# Altium project SystemM.PrjPCB
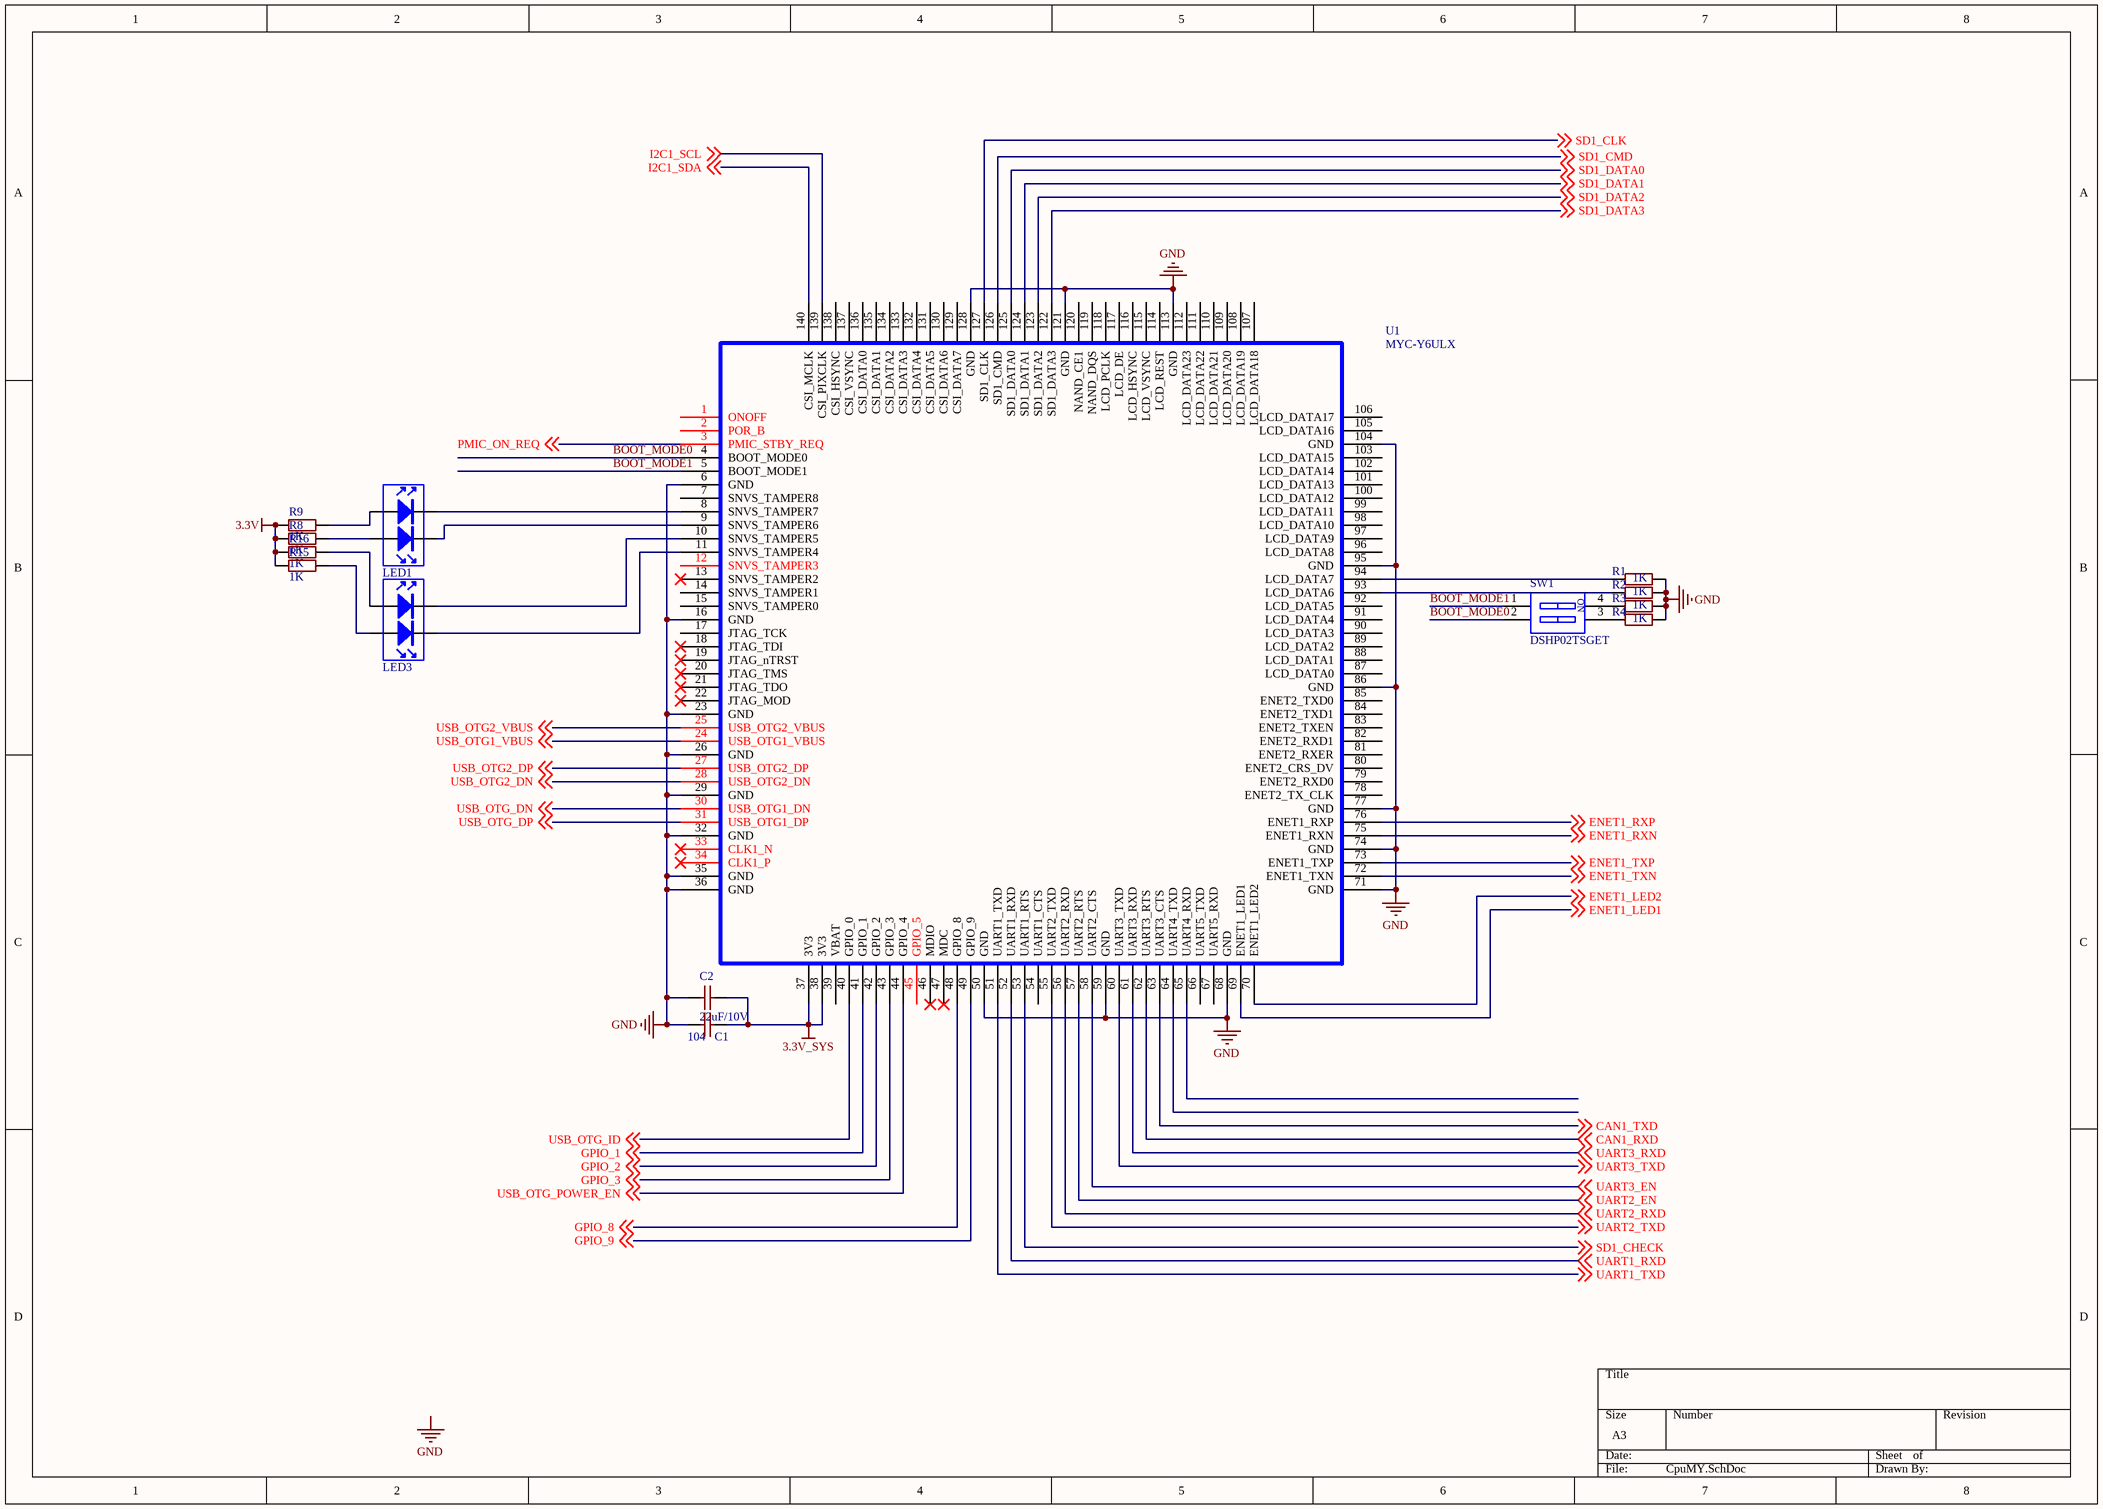
[diagram p0: CpuMY.SchDoc]
6 sheets, 120 parts. Net scope: global (net labels, ports and power ports of the same name join across sheets).
Board file: SystemM.PcbDoc
Sheets:
  CpuMY.SchDoc
  Gpio_RTC.SchDoc
  NetMY.SchDoc
  Power.SchDoc
  Uart_Can.SchDoc
  Usb_SdCard.SchDoc

## Sheet CpuMY.SchDoc
size A3

### Parts
C1  104  [0805SMD_Cap]
C2  22uF/10V  [0805SMD_Cap]
LED1  LED_1  [DIP LED]  (value not drawn)
LED3  LED_1  [DIP LED]  (value not drawn)
R1  1K  [0805_SMD_R]
R2  1K  [0805_SMD_R]
R3  1K  [0805_SMD_R]
R4  1K  [0805_SMD_R]
R8  1K  [0805_SMD_R]
R9  1K  [0805_SMD_R]
R15  1K  [0805_SMD_R]
R16  1K  [0805_SMD_R]
SW1  DSHP02TSGET  [DSHP02TSGET]
U1  MYC-Y6ULX  [MYIMX6]

### Nets
3.3V: R8.1 R9.1 R15.2 R16.2
3.3V_SYS: C1.2 C2.1 U1.37(3V3) U1.38(3V3)
GND: C1.1 C2.2 R1.2 R2.2 R3.2 R4.2 U1.6(GND) U1.16(GND) U1.23(GND) U1.26(GND) U1.29(GND) U1.32(GND) U1.35(GND) U1.36(GND) U1.50(GND) U1.59(GND) U1.68(GND) U1.71(GND) U1.74(GND) U1.77(GND) U1.86(GND) U1.95(GND) U1.104(GND) U1.113(GND) U1.121(GND) U1.128(GND)
BOOT_MODE0: SW1.2(A2) U1.4(BOOT_MODE0)
BOOT_MODE1: SW1.1(A1) U1.5(BOOT_MODE1)
CAN1_RXD: U1.62(UART3_RTS) ; off-sheet CAN1_RXD
CAN1_TXD: U1.63(UART3_CTS) ; off-sheet CAN1_TXD
ENET1_LED1: U1.69(ENET1_LED1) ; off-sheet ENET1_LED1
ENET1_LED2: U1.70(ENET1_LED2) ; off-sheet ENET1_LED2
ENET1_RXN: U1.75(ENET1_RXN) ; off-sheet ENET1_RXN
ENET1_RXP: U1.76(ENET1_RXP) ; off-sheet ENET1_RXP
ENET1_TXN: U1.72(ENET1_TXN) ; off-sheet ENET1_TXN
ENET1_TXP: U1.73(ENET1_TXP) ; off-sheet ENET1_TXP
GPIO_1: U1.41(GPIO_1) ; off-sheet GPIO_1
GPIO_2: U1.42(GPIO_2) ; off-sheet GPIO_2
GPIO_3: U1.43(GPIO_3) ; off-sheet GPIO_3
GPIO_8: U1.48(GPIO_8) ; off-sheet GPIO_8
GPIO_9: U1.49(GPIO_9) ; off-sheet GPIO_9
I2C1_SCL: U1.139(CSI_PIXCLK) ; off-sheet I2C1_SCL
I2C1_SDA: U1.140(CSI_MCLK) ; off-sheet I2C1_SDA
PMIC_ON_REQ: U1.3(PMIC_STBY_REQ) ; off-sheet PMIC_ON_REQ
SD1_CHECK: U1.53(UART1_RTS) ; off-sheet SD1_CHECK
SD1_CLK: U1.127(SD1_CLK) ; off-sheet SD1_CLK
SD1_CMD: U1.126(SD1_CMD) ; off-sheet SD1_CMD
SD1_DATA0: U1.125(SD1_DATA0) ; off-sheet SD1_DATA0
SD1_DATA1: U1.124(SD1_DATA1) ; off-sheet SD1_DATA1
SD1_DATA2: U1.123(SD1_DATA2) ; off-sheet SD1_DATA2
SD1_DATA3: U1.122(SD1_DATA3) ; off-sheet SD1_DATA3
UART1_RXD: U1.52(UART1_RXD) ; off-sheet UART1_RXD
UART1_TXD: U1.51(UART1_TXD) ; off-sheet UART1_TXD
UART2_EN: U1.57(UART2_RTS) ; off-sheet UART2_EN
UART2_RXD: U1.56(UART2_RXD) ; off-sheet UART2_RXD
UART2_TXD: U1.55(UART2_TXD) ; off-sheet UART2_TXD
UART3_EN: U1.58(UART2_CTS) ; off-sheet UART3_EN
UART3_RXD: U1.61(UART3_RXD) ; off-sheet UART3_RXD
UART3_TXD: U1.60(UART3_TXD) ; off-sheet UART3_TXD
USB_OTG1_VBUS: U1.24(USB_OTG1_VBUS) ; off-sheet USB_OTG1_VBUS
USB_OTG2_DN: U1.28(USB_OTG2_DN) ; off-sheet USB_OTG2_DN
USB_OTG2_DP: U1.27(USB_OTG2_DP) ; off-sheet USB_OTG2_DP
USB_OTG2_VBUS: U1.25(USB_OTG2_VBUS) ; off-sheet USB_OTG2_VBUS
USB_OTG_DN: U1.30(USB_OTG1_DN) ; off-sheet USB_OTG_DN
USB_OTG_DP: U1.31(USB_OTG1_DP) ; off-sheet USB_OTG_DP
USB_OTG_ID: U1.40(GPIO_0) ; off-sheet USB_OTG_ID
USB_OTG_POWER_EN: U1.44(GPIO_4) ; off-sheet USB_OTG_POWER_EN
NetLED1_1: LED1.1 R9.2
NetLED1_2: LED1.2 U1.8(SNVS_TAMPER7)
NetLED1_3: LED1.3 R8.2
NetLED1_4: LED1.4 U1.9(SNVS_TAMPER6)
NetLED3_1: LED3.1 R16.1
NetLED3_2: LED3.2 U1.10(SNVS_TAMPER5)
NetLED3_3: LED3.3 R15.1
NetLED3_4: LED3.4 U1.11(SNVS_TAMPER4)
NetR1_1: R1.1 U1.94(LCD_DATA7)
NetR2_1: R2.1 U1.93(LCD_DATA6)
NetR3_1: R3.1 SW1.4(B1)
NetR4_1: R4.1 SW1.3(B2)

Not connected (* = marked no-connect by the designer): U1 1(ONOFF) 2(POR_B) 7(SNVS_TAMPER8) 12(SNVS_TAMPER3) 13(SNVS_TAMPER2)* 14(SNVS_TAMPER1) 15(SNVS_TAMPER0) 17(JTAG_TCK) 18(JTAG_TDI)* 19(JTAG_nTRST)* 20(JTAG_TMS)* 21(JTAG_TDO)* 22(JTAG_MOD)* 33(CLK1_N)* 34(CLK1_P)* 39(VBAT) 45(GPIO_5) 46(MDIO)* 47(MDC)* 54(UART1_CTS) 64(UART4_TXD) 65(UART4_RXD) 66(UART5_TXD) 67(UART5_RXD) 78(ENET2_TX_CLK) 79(ENET2_RXD0) 80(ENET2_CRS_DV) 81(ENET2_RXER) 82(ENET2_RXD1) 83(ENET2_TXEN) 84(ENET2_TXD1) 85(ENET2_TXD0) 87(LCD_DATA0) 88(LCD_DATA1) 89(LCD_DATA2) 90(LCD_DATA3) 91(LCD_DATA4) 92(LCD_DATA5) 96(LCD_DATA8) 97(LCD_DATA9) 98(LCD_DATA10) 99(LCD_DATA11) 100(LCD_DATA12) 101(LCD_DATA13) 102(LCD_DATA14) 103(LCD_DATA15) 105(LCD_DATA16) 106(LCD_DATA17) 107(LCD_DATA18) 108(LCD_DATA19) 109(LCD_DATA20) 110(LCD_DATA21) 111(LCD_DATA22) 112(LCD_DATA23) 114(LCD_REST) 115(LCD_VSYNC) 116(LCD_HSYNC) 117(LCD_DE) 118(LCD_PCLK) 119(NAND_DQS) 120(NAND_CE1) 129(CSI_DATA7) 130(CSI_DATA6) 131(CSI_DATA5) 132(CSI_DATA4) 133(CSI_DATA3) 134(CSI_DATA2) 135(CSI_DATA1) 136(CSI_DATA0) 137(CSI_VSYNC) 138(CSI_HSYNC)

### Notes on the sheet
- Labels drawn without touching a wire or pin: GND
- (in symbol 拨码开关) ON

### Library data of the parts
C1 = SMD_Cap: 贴片电容; 研究所: 贴装电容_0805_0.1uF; 松下: GR21BB1H104K; 松下: GR21BB1H224K; 松下: GR21BB1H103K; 研究所: 贴装电容_0805_0.22uF; 研究所: 贴装电容_0805_0.01uF; 松下: GR21BB1H473K; 研究所: 贴装电容_0805_0.047uF; 松下: GR21BB1H300K; 研究所: 贴装电容_0805_30pF; 松下: GR21BB1H105K; 研究所: 贴装电容_0805_1uF; 松下: GR21BB1H472K; 研究所: 贴装电容_0805_4700pF
C2 = SMD_Cap: 贴片电容; 研究所: 贴装电容_0805_4700pF; 松下: GR21BB1H472K
LED1 LED3 = LED_1: 发光二极管
R1-R4 R8 R9 R15 R16 = SMD_0805: 贴片电阻; 松下: RS05K101FT; 松下: RS05000FT; 松下: RS05K3321FT; 松下: RS05K6811FT; 松下: RS05K102FT; 松下: RS05K2211FT; 松下: RS05K103FT; 松下: RS05K5111FT; 松下: RS05K5110FT; 松下: RS05K5112FT; 松下: RS05K8251FT; 松下: RS05K2212FT; 松下: RS05K104FT; 松下: RS05K5113FT; 松下: RS05K105FT; 松下: RS05L106FT; 研究所: 贴装电阻_0805_0_F1%; 研究所: 贴装电阻_0805_100_F1%; 研究所: 贴装电阻_0805_51.1K_F1%; 研究所: 贴装电阻_0805_1K_F1%; 研究所: 贴装电阻_0805_2.21K_F1%; 研究所: 贴装电阻_0805_3.32K_F1%; 研究所: 贴装电阻_0805_5.11K_F1%; 研究所: 贴装电阻_0805_511K_F1%; 研究所: 贴装电阻_0805_6.81K_F1%; 研究所: 贴装电阻_0805_511_F1%; 研究所: 贴装电阻_0805_8.25K_F1%; 研究所: 贴装电阻_0805_10K_F1%; 研究所: 贴装电阻_0805_22.1K_F1%; 研究所: 贴装电阻_0805_100K_F1%; 研究所: 贴装电阻_0805_1M_F1%; 研究所: 贴装电阻_0805_10M_F1%
SW1 = 拨码开关

## Sheet Gpio_RTC.SchDoc
size A4
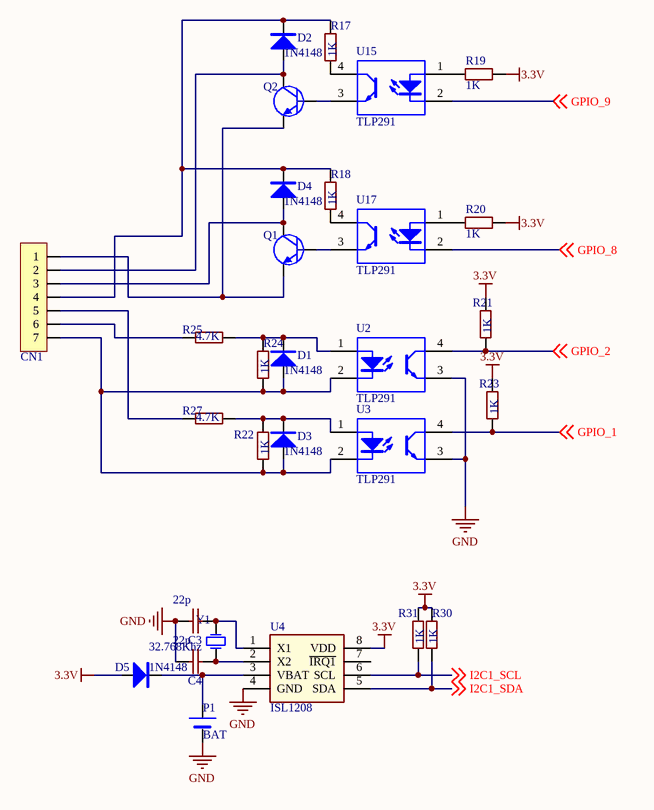
[diagram p1: Gpio_RTC.SchDoc]

### Parts
C3  22p  [0805SMD_Cap]
C4  22p  [0805SMD_Cap]
CN1  CON7  [WJ15EDGRM-3.81-7P]  (value not drawn)
D1  1N4148  [二极管SOD-123]
D2  1N4148  [二极管SOD-123]
D3  1N4148  [二极管SOD-123]
D4  1N4148  [二极管SOD-123]
D5  1N4148  [二极管SOD-123]
P1  BAT  [CR1220]
Q1  1318  [SOT-23]  (value not drawn)
Q2  1318  [SOT-23]  (value not drawn)
R17  1K  [0805_SMD_R]
R18  1K  [0805_SMD_R]
R19  1K  [0805_SMD_R]
R20  1K  [0805_SMD_R]
R21  1K  [0805_SMD_R]
R22  1K  [0805_SMD_R]
R23  1K  [0805_SMD_R]
R24  1K  [0805_SMD_R]
R25  4.7K  [0805_SMD_R]
R27  4.7K  [0805_SMD_R]
R30  1K  [0805_SMD_R]
R31  1K  [0805_SMD_R]
U2  TLP291  [sop-4]
U3  TLP291  [sop-4]
U4  ISL1208  [运放SO8]
U15  TLP291  [sop-4]
U17  TLP291  [sop-4]
Y1  32.768Khz  [XTAL_0503_2Pin]

### Nets
3.3V: D5.A R19.1 R20.1 R21.2 R23.2 R30.1 R31.1 U4.8(VDD)
GND: C3.1 C4.1 P1.2(-) U2.3 U3.3 U4.4(GND)
GPIO_1: R23.1 U3.4 ; off-sheet GPIO_1
GPIO_2: R21.1 U2.4 ; off-sheet GPIO_2
GPIO_8: U17.2 ; off-sheet GPIO_8
GPIO_9: U15.2 ; off-sheet GPIO_9
I2C1_SCL: R31.2 U4.6(SCL) ; off-sheet I2C1_SCL
I2C1_SDA: R30.2 U4.5(SDA) ; off-sheet I2C1_SDA
NetC3_2: C3.2 U4.1(X1) Y1.2(OSC2)
NetC4_2: C4.2 U4.2(X2) Y1.1(OSC1)
NetCN1_1: CN1.1 Q1.2(E) Q2.2(E)
NetCN1_2: CN1.2 D2.A Q2.3(C)
NetCN1_3: CN1.3 D4.A Q1.3(C)
NetCN1_4: CN1.4 D2.K D4.K R17.2 R18.2
NetCN1_5: CN1.5 R27.1
NetCN1_6: CN1.6 R25.1
NetCN1_7: CN1.7 D1.A D3.A R22.1 R24.1 U2.2 U3.2
NetD1_K: D1.K R24.2 R25.2 U2.1
NetD3_K: D3.K R22.2 R27.2 U3.1
NetD5_K: D5.K P1.1(+) U4.3(VBAT)
NetQ1_1: Q1.1(B) U17.3
NetQ2_1: Q2.1(B) U15.3
NetR17_1: R17.1 U15.4
NetR18_1: R18.1 U17.4
NetR19_2: R19.2 U15.1
NetR20_2: R20.2 U17.1

Not connected (* = marked no-connect by the designer): U4 7(~{IR}~{Q1})

### Library data of the parts
C3 C4 = SMD_Cap: as C1 on sheet CpuMY
CN1 = CON7: 连接器; 松下: B6BXH2TV4
D1-D5 = DIODE: 二极管
Q1 Q2 = 三极管: Published: 8-Jun-2000; LatestRevisionDate: 17-Jul-2002; LatestRevisionNote: Re-released for DXP Platform.; PackageReference: TO-226; Publisher: Altium Limited; Code_JEDEC: TO-226-AA
R17-R25 R27 R30 R31 = SMD_0805: as R1 on sheet CpuMY
U4 = ISL1208: 时钟芯片
Y1 = XTAL: 无源晶振贴装; Published: 8-Jun-2000; LatestRevisionDate: 17-Jul-2002; LatestRevisionNote: Re-released for DXP Platform.; PackageReference: R38; Publisher: Altium Limited

## Sheet NetMY.SchDoc
size A4
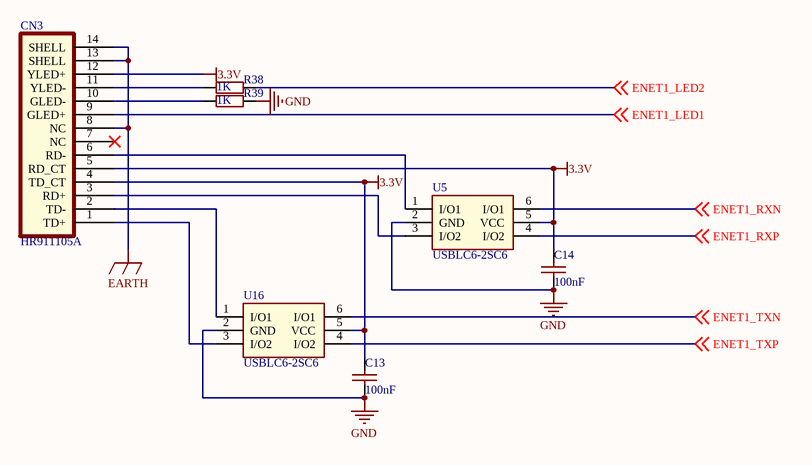
[diagram p2: NetMY.SchDoc]

### Parts
C13  100nF  [0805SMD_Cap]
C14  100nF  [0805SMD_Cap]
CN3  HR911105A  [RJ-45A12]
R38  1K  [0805_SMD_R]
R39  1K  [0805_SMD_R]
U5  USBLC6-2SC6  [SOT-23-6]
U16  USBLC6-2SC6  [SOT-23-6]

### Nets
3.3V: C13.2 C14.2 CN3.4(TD_CT) CN3.5(RD_CT) CN3.12(YLED+) U5.5(VCC) U16.5(VCC)
EARTH: CN3.8(NC) CN3.13(SHELL) CN3.14(SHELL)
GND: C13.1 C14.1 R39.2 U5.2(GND) U16.2(GND)
ENET1_LED1: CN3.9(GLED+) ; off-sheet ENET1_LED1
ENET1_LED2: R38.2 ; off-sheet ENET1_LED2
ENET1_RXN: U5.6(I/O1) ; off-sheet ENET1_RXN
ENET1_RXP: U5.4(I/O2) ; off-sheet ENET1_RXP
ENET1_TXN: U16.6(I/O1) ; off-sheet ENET1_TXN
ENET1_TXP: U16.4(I/O2) ; off-sheet ENET1_TXP
NetCN3_1: CN3.1(TD+) U16.3(I/O2)
NetCN3_2: CN3.2(TD-) U16.1(I/O1)
NetCN3_3: CN3.3(RD+) U5.3(I/O2)
NetCN3_6: CN3.6(RD-) U5.1(I/O1)
NetCN3_10: CN3.10(GLED-) R39.1
NetCN3_11: CN3.11(YLED-) R38.1

Not connected (* = marked no-connect by the designer): CN3 7(NC)*

### Library data of the parts
C13 C14 = SMD_Cap: as C2 on sheet CpuMY
R38 R39 = SMD_0805: as R1 on sheet CpuMY

## Sheet Power.SchDoc
size A4
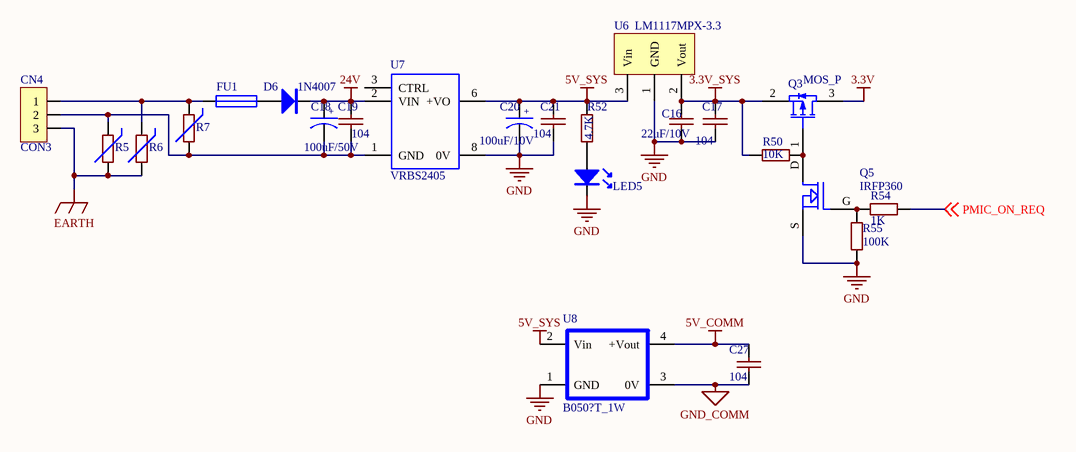
[diagram p3: Power.SchDoc]

### Parts
C16  22uF/10V  [0805SMD_Cap]
C17  104  [0805SMD_Cap]
C18  100uF/50V  [电解电容-10]
C19  104  [0805SMD_Cap]
C20  100uF/10V  [电解电容-10]
C21  104  [0805SMD_Cap]
C27  104  [0805SMD_Cap]
CN4  CON3  [WJ15EDGRM-3.81-3P-14-00A]
D6  1N4007  [二极管SMA]
FU1  FUSE1  [RAD0.2]  (value not drawn)
LED5  LED  [发光二极管0805]  (value not drawn)
Q3  MOS_P  [SOT-23]
Q5  IRFP360  [SOT-23 - MOS]
R5  10d330K  [RAD0.2]  (value not drawn)
R6  10d330K  [RAD0.2]  (value not drawn)
R7  10d330K  [RAD0.2]  (value not drawn)
R50  10K  [0805_SMD_R]
R52  4.7K  [0805_SMD_R]
R54  1K  [0805_SMD_R]
R55  100K  [0805_SMD_R]
U6  LM1117MPX-3.3  [SOT-223]
U7  VRBS2405  [VRB_S]
U8  B050?T_1W  [B0505S_1W]

### Nets
3.3V: Q3.3(D)
3.3V_SYS: C16.1 C17.1 Q3.2(S) R50.2 U6.2(Vout)
5V_COMM: C27.1 U8.4(+Vout)
5V_SYS: C20.1 C21.1 R52.2 U6.3(Vin) U7.6(+VO) U8.2(Vin)
24V: C18.1 C19.1 D6.K U7.2(VIN)
EARTH: CN4.3 R5.1 R6.1
GND: C16.2 C17.2 C20.2 C21.2 LED5.K Q5.S(SOURCE) R55.2 U6.1(GND) U7.8(0V) U8.1(GND)
GND_COMM: C27.2 U8.3(0V)
PMIC_ON_REQ: R54.1 ; off-sheet PMIC_ON_REQ
NetC18_2: C18.2 C19.2 CN4.2 R5.2 R7.1 U7.1(GND)
NetCN4_1: CN4.1 FU1.1 R6.2 R7.2
NetD6_A: D6.A FU1.2
NetLED5_A: LED5.A R52.1
NetQ3_1: Q3.1(G) Q5.D(DRAIN) R50.1
NetQ5_G: Q5.G(GATE) R54.2 R55.1

Not connected (* = marked no-connect by the designer): U7 3(CTRL) 5(NC) 7(NC)

### Notes on the sheet
- (in symbol CAP  POL) +

### Library data of the parts
C16 = SMD_Cap: as C2 on sheet CpuMY
C17 C19 C21 C27 = SMD_Cap: as C1 on sheet CpuMY
C18 C20 = CAP  POL: 电解电容; Value: R1HCX010MT50
CN4 = CON3: 连接器; 松下: B3PVHB
D6 = DIODE: 二极管
FU1 = FUSE1: 保险
LED5 = LED: 发光二极管
Q5 = MOSFET N: MOS管
R5-R7 = 压敏电阻: 松下: RS05K101FT; 松下: RS05000FT; 松下: RS05K3321FT; 松下: RS05K6811FT; 松下: RS05K102FT; 松下: RS05K2211FT; 松下: RS05K103FT; 松下: RS05K5111FT; 松下: RS05K5110FT; 松下: RS05K5112FT; 松下: RS05K8251FT; 松下: RS05K2212FT; 松下: RS05K104FT; 松下: RS05K5113FT; 松下: RS05K105FT; 松下: RS05L106FT; 研究所: 贴装电阻_0805_0_F1%; 研究所: 贴装电阻_0805_100_F1%; 研究所: 贴装电阻_0805_51.1K_F1%; 研究所: 贴装电阻_0805_1K_F1%; 研究所: 贴装电阻_0805_2.21K_F1%; 研究所: 贴装电阻_0805_3.32K_F1%; 研究所: 贴装电阻_0805_5.11K_F1%; 研究所: 贴装电阻_0805_511K_F1%; 研究所: 贴装电阻_0805_6.81K_F1%; 研究所: 贴装电阻_0805_511_F1%; 研究所: 贴装电阻_0805_8.25K_F1%; 研究所: 贴装电阻_0805_10K_F1%; 研究所: 贴装电阻_0805_22.1K_F1%; 研究所: 贴装电阻_0805_100K_F1%; 研究所: 贴装电阻_0805_1M_F1%; 研究所: 贴装电阻_0805_10M_F1%
R50 R52 R54 R55 = SMD_0805: as R1 on sheet CpuMY
U6 = LM1117MPX-3.3: LM1117 3.3V固定输出; 编号: B00004; 名称: 贴装芯片_LM1117MPX-3.3
U8 = B0505S_1W

## Sheet Uart_Can.SchDoc
size A4
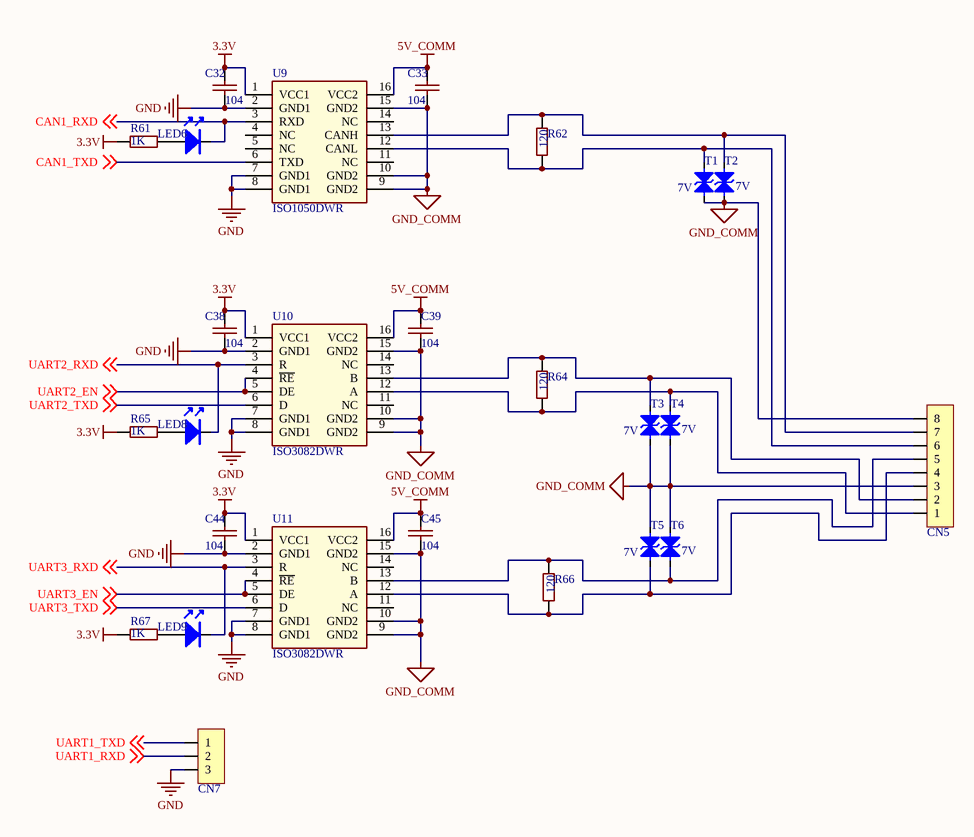
[diagram p4: Uart_Can.SchDoc]

### Parts
C32  104  [0805SMD_Cap]
C33  104  [0805SMD_Cap]
C38  104  [0805SMD_Cap]
C39  104  [0805SMD_Cap]
C44  104  [0805SMD_Cap]
C45  104  [0805SMD_Cap]
CN5  CON8  [WJ15EDGRM-3.81-8P]  (value not drawn)
CN7  CON3  [DIP3]  (value not drawn)
LED6  LED  [发光二极管0805]  (value not drawn)
LED8  LED  [发光二极管0805]  (value not drawn)
LED9  LED  [发光二极管0805]  (value not drawn)
R61  1K  [0805_SMD_R]
R62  120  [0805_SMD_R]
R64  120  [0805_SMD_R]
R65  1K  [0805_SMD_R]
R66  120  [0805_SMD_R]
R67  1K  [0805_SMD_R]
T1  7V  [二极管SMA]
T2  7V  [二极管SMA]
T3  7V  [二极管SMA]
T4  7V  [二极管SMA]
T5  7V  [二极管SMA]
T6  7V  [二极管SMA]
U9  ISO1050DWR  [SOIC_16]
U10  ISO3082DWR  [SOIC_16]
U11  ISO3082DWR  [SOIC_16]

### Nets
3.3V: C32.2 C38.2 C44.2 R61.2 R65.2 R67.2 U9.1(VCC1) U10.1(VCC1) U11.1(VCC1)
5V_COMM: C33.2 C39.2 C45.2 U9.16(VCC2) U10.16(VCC2) U11.16(VCC2)
GND: C32.1 C38.1 C44.1 CN7.3 U9.2(GND1) U9.7(GND1) U9.8(GND1) U10.2(GND1) U10.7(GND1) U10.8(GND1) U11.2(GND1) U11.7(GND1) U11.8(GND1)
GND_COMM: C33.1 C39.1 C45.1 CN5.3 CN5.8 T1.A T2.A T3.A T4.A T5.K T6.K U9.9(GND2) U9.10(GND2) U9.15(GND2) U10.9(GND2) U10.10(GND2) U10.15(GND2) U11.9(GND2) U11.10(GND2) U11.15(GND2)
CAN1_RXD: LED6.K U9.3(RXD) ; off-sheet CAN1_RXD
CAN1_TXD: U9.6(TXD) ; off-sheet CAN1_TXD
UART1_RXD: CN7.2 ; off-sheet UART1_RXD
UART1_TXD: CN7.1 ; off-sheet UART1_TXD
UART2_EN: U10.4(~{RE}) U10.5(DE) ; off-sheet UART2_EN
UART2_RXD: LED8.K U10.3(R) ; off-sheet UART2_RXD
UART2_TXD: U10.6(D) ; off-sheet UART2_TXD
UART3_EN: U11.4(~{RE}) U11.5(DE) ; off-sheet UART3_EN
UART3_RXD: LED9.K U11.3(R) ; off-sheet UART3_RXD
UART3_TXD: U11.6(D) ; off-sheet UART3_TXD
NetCN5_1: CN5.1 R64.1 T4.K U10.12(A)
NetCN5_2: CN5.2 R64.2 T3.K U10.13(B)
NetCN5_4: CN5.4 R66.1 T5.A U11.12(A)
NetCN5_5: CN5.5 R66.2 T6.A U11.13(B)
NetCN5_6: CN5.6 R62.1 T1.K U9.12(CANL)
NetCN5_7: CN5.7 R62.2 T2.K U9.13(CANH)
NetLED6_A: LED6.A R61.1
NetLED8_A: LED8.A R65.1
NetLED9_A: LED9.A R67.1

Not connected (* = marked no-connect by the designer): U9 4(NC) 5(NC) 11(NC) 14(NC); U10 11(NC) 14(NC); U11 11(NC) 14(NC)

### Library data of the parts
C32 C33 C38 C39 C44 C45 = SMD_Cap: as C1 on sheet CpuMY
CN5 = CON8: 连接器; 松下: B9PVHB
CN7 = CON3: 连接器; 松下: B3PVHB
LED6 LED8 LED9 = LED: 发光二极管
R61 R62 R64-R67 = SMD_0805: as R1 on sheet CpuMY
T1-T6 = 双向TVS_?V(SMA): 名称: 贴装元件_双向TVS_7V(SMA)
U9 = ISO1050DWR: CAN隔离芯片
U10 U11 = ISO3082DWR: 485隔离芯片

## Sheet Usb_SdCard.SchDoc
size A4
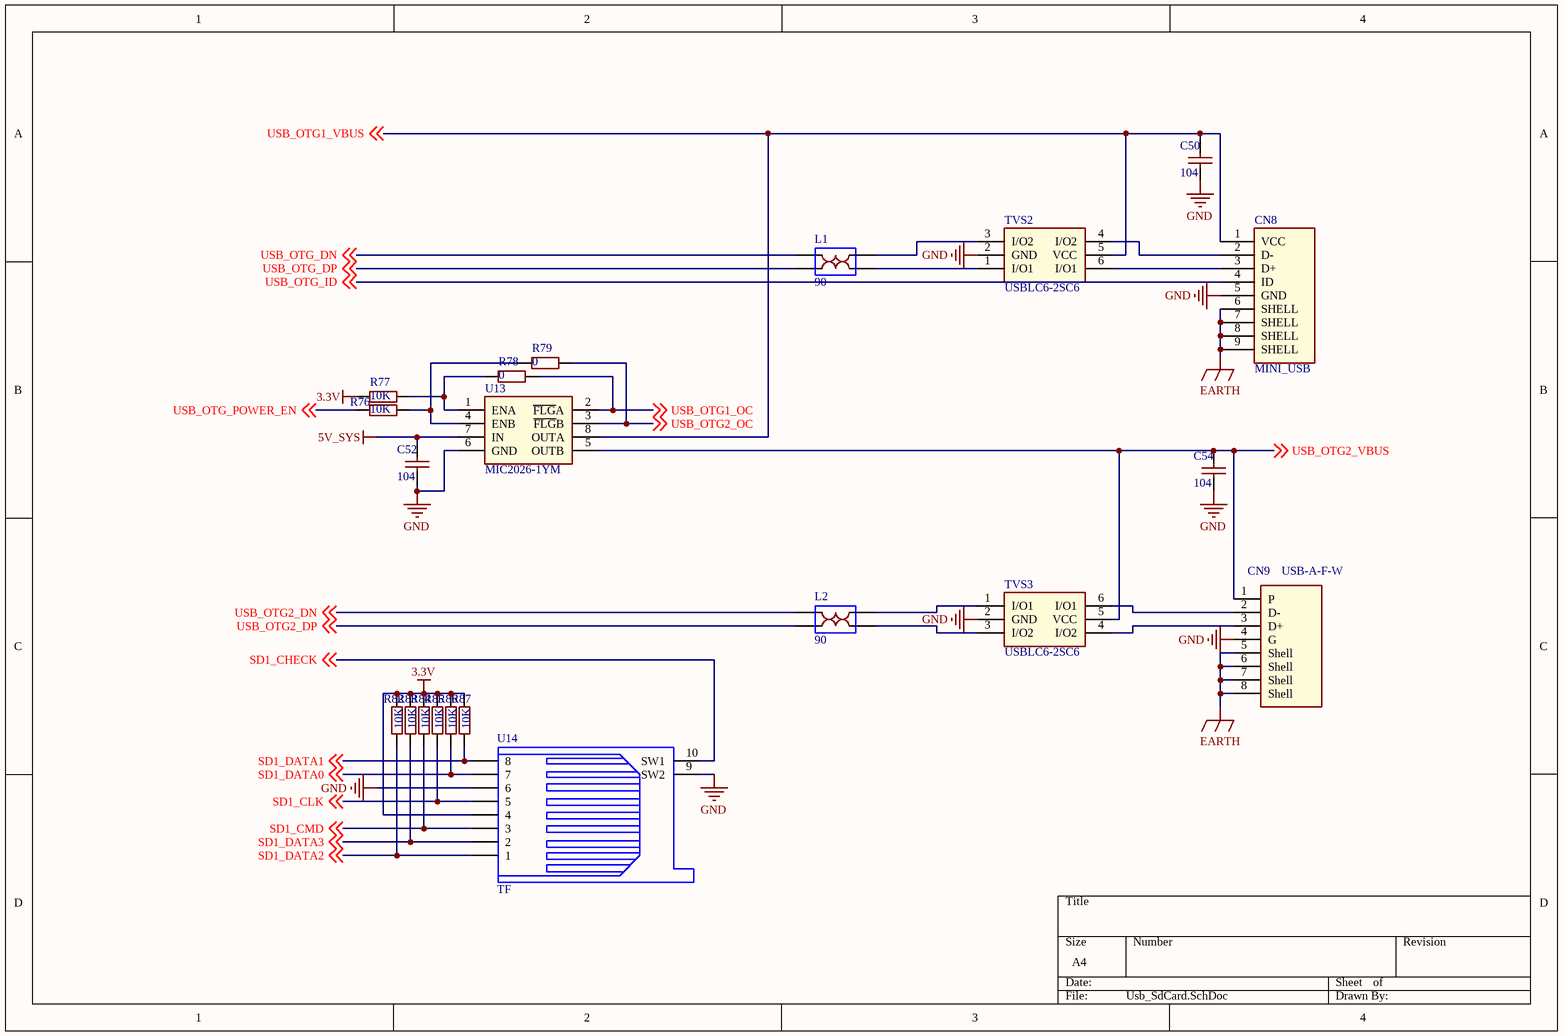
[diagram p5: Usb_SdCard.SchDoc]

### Parts
C50  104  [0805SMD_Cap]
C52  104  [0805SMD_Cap]
C54  104  [0805SMD_Cap]
CN8  MINI_USB  [MICRO_USB]
CN9  USB-A-F-W  [USB-C]
L1  90  [2012]
L2  90  [2012]
R76  10K  [0805_SMD_R]
R77  10K  [0805_SMD_R]
R78  0  [0805_SMD_R]
R79  0  [0805_SMD_R]
R82  10K  [0805_SMD_R]
R83  10K  [0805_SMD_R]
R84  10K  [0805_SMD_R]
R85  10K  [0805_SMD_R]
R86  10K  [0805_SMD_R]
R87  10K  [0805_SMD_R]
TVS2  USBLC6-2SC6  [SOT-23-6]
TVS3  USBLC6-2SC6  [SOT-23-6]
U13  MIC2026-1YM  [运放SO8]
U14  TF  [TF]

### Nets
3.3V: R77.2 R82.2 R83.2 R84.2 R85.2 R86.2 R87.2 U14.4
5V_SYS: C52.1 U13.7(IN)
EARTH: CN8.6(SHELL) CN8.7(SHELL) CN8.8(SHELL) CN8.9(SHELL) CN9.5(Shell) CN9.6(Shell) CN9.7(Shell) CN9.8(Shell)
GND: C50.2 C52.2 C54.2 CN8.5(GND) CN9.4(G) TVS2.2(GND) TVS3.2(GND) U13.6(GND) U14.6 U14.9(SW2)
SD1_CHECK: U14.10(SW1) ; off-sheet SD1_CHECK
SD1_CLK: R85.1 U14.5 ; off-sheet SD1_CLK
SD1_CMD: R84.1 U14.3 ; off-sheet SD1_CMD
SD1_DATA0: R86.1 U14.7 ; off-sheet SD1_DATA0
SD1_DATA1: R87.1 U14.8 ; off-sheet SD1_DATA1
SD1_DATA2: R82.1 U14.1 ; off-sheet SD1_DATA2
SD1_DATA3: R83.1 U14.2 ; off-sheet SD1_DATA3
USB_OTG1_OC: R78.1 U13.2(~{FLG}A) ; off-sheet USB_OTG1_OC
USB_OTG1_VBUS: C50.1 CN8.1(VCC) TVS2.5(VCC) U13.8(OUTA) ; off-sheet USB_OTG1_VBUS
USB_OTG2_DN: L2.1 ; off-sheet USB_OTG2_DN
USB_OTG2_DP: L2.2 ; off-sheet USB_OTG2_DP
USB_OTG2_OC: R79.1 U13.3(~{FLG}B) ; off-sheet USB_OTG2_OC
USB_OTG2_VBUS: C54.1 CN9.1(P) TVS3.5(VCC) U13.5(OUTB) ; off-sheet USB_OTG2_VBUS
USB_OTG_DN: L1.2 ; off-sheet USB_OTG_DN
USB_OTG_DP: L1.1 ; off-sheet USB_OTG_DP
USB_OTG_ID: CN8.4(ID) ; off-sheet USB_OTG_ID
USB_OTG_POWER_EN: R76.2 ; off-sheet USB_OTG_POWER_EN
NetCN8_2: CN8.2(D-) TVS2.4(I/O2)
NetCN8_3: CN8.3(D+) TVS2.6(I/O1)
NetCN9_2: CN9.2(D-) TVS3.6(I/O1)
NetCN9_3: CN9.3(D+) TVS3.4(I/O2)
NetL1_3: L1.3 TVS2.3(I/O2)
NetL1_4: L1.4 TVS2.1(I/O1)
NetL2_3: L2.3 TVS3.3(I/O2)
NetL2_4: L2.4 TVS3.1(I/O1)
NetR76_1: R76.1 R79.2 U13.4(ENB)
NetR77_1: R77.1 R78.2 U13.1(ENA)

### Library data of the parts
C50 C52 C54 = SMD_Cap: as C1 on sheet CpuMY
L1 L2 = 共模电感
R76-R79 R82-R87 = SMD_0805: as R1 on sheet CpuMY

## Nets that join several sheets
3.3V: CpuMY (R8.1 R9.1 R15.2 R16.2), Gpio_RTC (8 pins), NetMY (7 pins), Power (Q3.3), Uart_Can (9 pins), Usb_SdCard (8 pins)
3.3V_SYS: CpuMY (C1.2 C2.1 U1.37 U1.38), Power (5 pins)
5V_COMM: Power (C27.1 U8.4), Uart_Can (6 pins)
5V_SYS: Power (6 pins), Usb_SdCard (C52.1 U13.7)
EARTH: NetMY (CN3.8 CN3.13 CN3.14), Power (CN4.3 R5.1 R6.1), Usb_SdCard (8 pins)
GND: CpuMY (26 pins), Gpio_RTC (6 pins), NetMY (5 pins), Power (10 pins), Uart_Can (13 pins), Usb_SdCard (10 pins)
GND_COMM: Power (C27.2 U8.3), Uart_Can (20 pins)
CAN1_RXD: CpuMY (U1.62), Uart_Can (LED6.K U9.3)
CAN1_TXD: CpuMY (U1.63), Uart_Can (U9.6)
ENET1_LED1: CpuMY (U1.69), NetMY (CN3.9)
ENET1_LED2: CpuMY (U1.70), NetMY (R38.2)
ENET1_RXN: CpuMY (U1.75), NetMY (U5.6)
ENET1_RXP: CpuMY (U1.76), NetMY (U5.4)
ENET1_TXN: CpuMY (U1.72), NetMY (U16.6)
ENET1_TXP: CpuMY (U1.73), NetMY (U16.4)
GPIO_1: CpuMY (U1.41), Gpio_RTC (R23.1 U3.4)
GPIO_2: CpuMY (U1.42), Gpio_RTC (R21.1 U2.4)
GPIO_8: CpuMY (U1.48), Gpio_RTC (U17.2)
GPIO_9: CpuMY (U1.49), Gpio_RTC (U15.2)
I2C1_SCL: CpuMY (U1.139), Gpio_RTC (R31.2 U4.6)
I2C1_SDA: CpuMY (U1.140), Gpio_RTC (R30.2 U4.5)
PMIC_ON_REQ: CpuMY (U1.3), Power (R54.1)
SD1_CHECK: CpuMY (U1.53), Usb_SdCard (U14.10)
SD1_CLK: CpuMY (U1.127), Usb_SdCard (R85.1 U14.5)
SD1_CMD: CpuMY (U1.126), Usb_SdCard (R84.1 U14.3)
SD1_DATA0: CpuMY (U1.125), Usb_SdCard (R86.1 U14.7)
SD1_DATA1: CpuMY (U1.124), Usb_SdCard (R87.1 U14.8)
SD1_DATA2: CpuMY (U1.123), Usb_SdCard (R82.1 U14.1)
SD1_DATA3: CpuMY (U1.122), Usb_SdCard (R83.1 U14.2)
UART1_RXD: CpuMY (U1.52), Uart_Can (CN7.2)
UART1_TXD: CpuMY (U1.51), Uart_Can (CN7.1)
UART2_EN: CpuMY (U1.57), Uart_Can (U10.4 U10.5)
UART2_RXD: CpuMY (U1.56), Uart_Can (LED8.K U10.3)
UART2_TXD: CpuMY (U1.55), Uart_Can (U10.6)
UART3_EN: CpuMY (U1.58), Uart_Can (U11.4 U11.5)
UART3_RXD: CpuMY (U1.61), Uart_Can (LED9.K U11.3)
UART3_TXD: CpuMY (U1.60), Uart_Can (U11.6)
USB_OTG1_VBUS: CpuMY (U1.24), Usb_SdCard (C50.1 CN8.1 TVS2.5 U13.8)
USB_OTG2_DN: CpuMY (U1.28), Usb_SdCard (L2.1)
USB_OTG2_DP: CpuMY (U1.27), Usb_SdCard (L2.2)
USB_OTG2_VBUS: CpuMY (U1.25), Usb_SdCard (C54.1 CN9.1 TVS3.5 U13.5)
USB_OTG_DN: CpuMY (U1.30), Usb_SdCard (L1.2)
USB_OTG_DP: CpuMY (U1.31), Usb_SdCard (L1.1)
USB_OTG_ID: CpuMY (U1.40), Usb_SdCard (CN8.4)
USB_OTG_POWER_EN: CpuMY (U1.44), Usb_SdCard (R76.2)